# Altium schematic sheet X_core_Powerful_pull_up.SchDoc
size A4; SheetNumber: 7; SheetTotal: 7
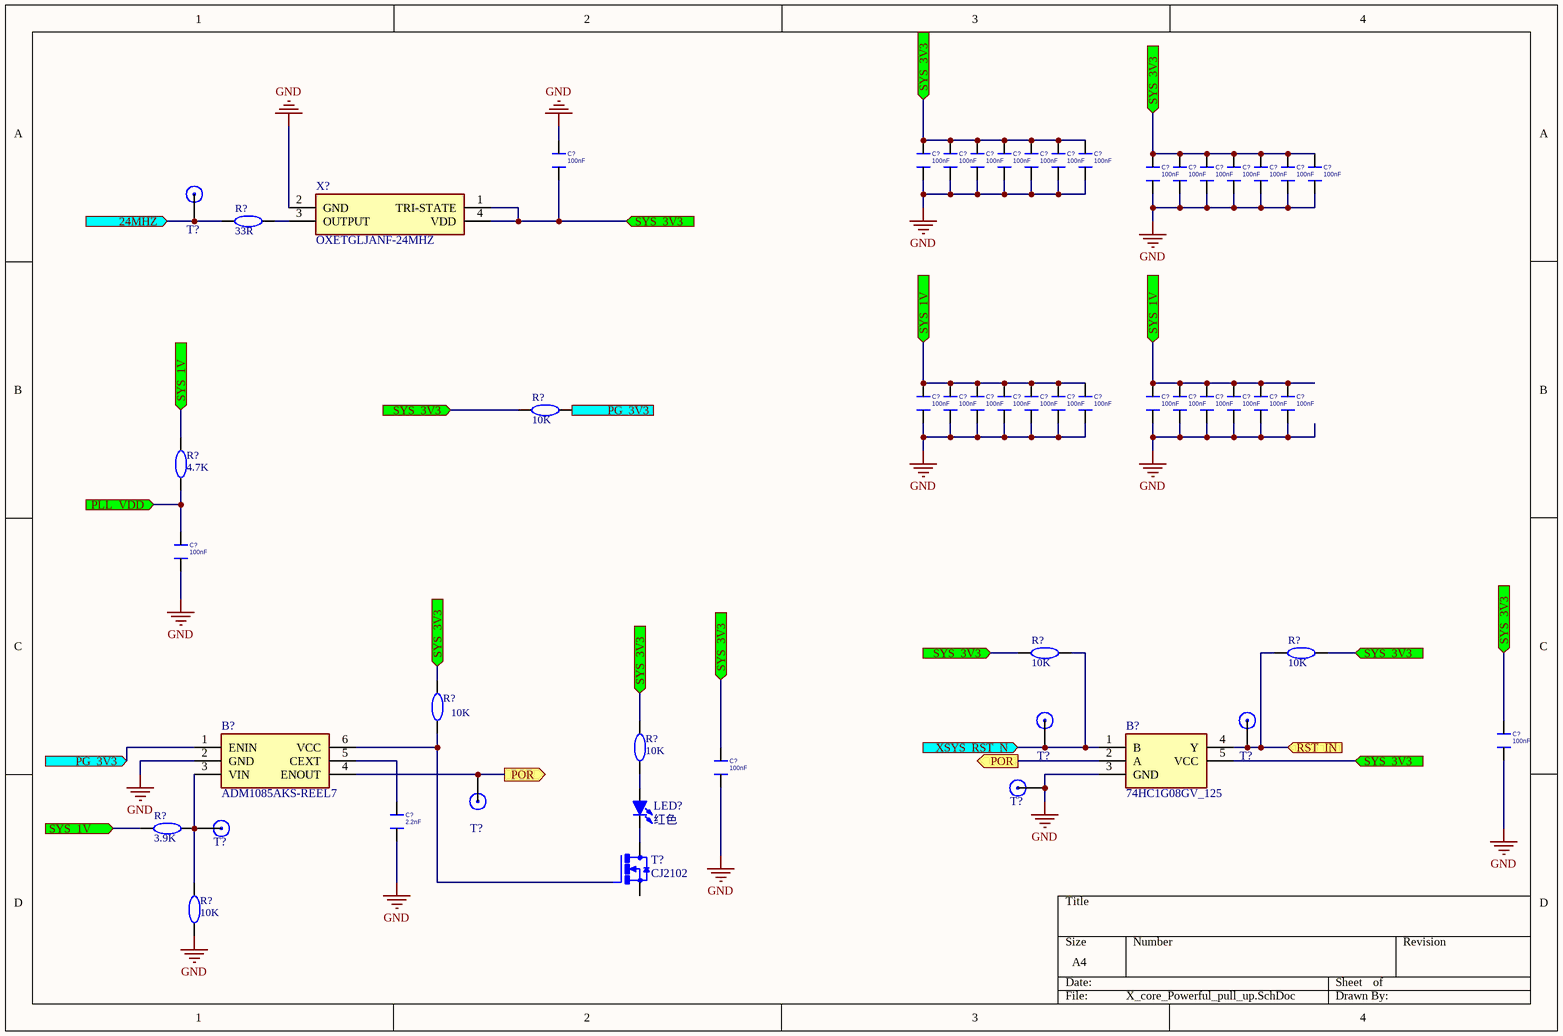
[diagram p0: X_core_Powerful_pull_up.SchDoc]

## Parts
(Parts that share a designator on the sheet are numbered #1, #2 ... from top to bottom, then left to right.)
B?#1  ADM1085AKS-REEL7  [SOT65P210X110-6N]
B?#2  74HC1G08GV_125  [SOT65P212X110-5N]
C?#1  100nF  [C0603]
C?#2  100nF  [C0603]
C?#3  100nF  [C0603]
C?#4  100nF  [C0603]
C?#5  100nF  [C0603]
C?#6  100nF  [C0603]
C?#7  100nF  [C0603]
C?#8  100nF  [C0603]
C?#9  100nF  [C0603]
C?#10  100nF  [C0603]
C?#11  100nF  [C0603]
C?#12  100nF  [C0603]
C?#13  100nF  [C0603]
C?#14  100nF  [C0603]
C?#15  100nF  [C0603]
C?#16  100nF  [C0603]
C?#17  100nF  [C0603]
C?#18  100nF  [C0603]
C?#19  100nF  [C0603]
C?#20  100nF  [C0603]
C?#21  100nF  [C0603]
C?#22  100nF  [C0603]
C?#23  100nF  [C0603]
C?#24  100nF  [C0603]
C?#25  100nF  [C0603]
C?#26  100nF  [C0603]
C?#27  100nF  [C0603]
C?#28  100nF  [C0603]
C?#29  100nF  [C0603]
C?#30  100nF  [C0603]
C?#31  100nF  [C0603]
C?#32  2.2nF  [C0603]
LED?  红色  [LED 0805G]
R?#1  Comment_1: 33R  [R 0603]  (hidden comment: 1A保险丝)
R?#2  1A保险丝  [R 0603]  (value not drawn)
R?#3  Comment_1: 4.7K  [R 0603]  (hidden comment: 1A保险丝)
R?#4  1A保险丝  [R 0603]  (value not drawn)
R?#5  1A保险丝  [R 0603]  (value not drawn)
R?#6  1A保险丝  [R 0603]  (value not drawn)
R?#7  1A保险丝  [R 0603]  (value not drawn)
R?#8  Comment_1: 3.9K  [R 0603]  (hidden comment: 1A保险丝)
R?#9  1A保险丝  [R 0603]  (value not drawn)
T?#1  Test_point  [Test_point]  (value not drawn)
T?#2  Test_point  [Test_point]  (value not drawn)
T?#3  Test_point  [Test_point]  (value not drawn)
T?#4  Test_point  [Test_point]  (value not drawn)
T?#5  Test_point  [Test_point]  (value not drawn)
T?#6  Test_point  [Test_point]  (value not drawn)
T?#7  CJ2102  [SOT23]
X?  OXETGLJANF-24MHZ  [OXETGLJANF24MHZ]

## Ports
24MHZ (in), PG_3V3 (in), PLL_VDD (in), POR (out), RST_IN (in), SYS_1V (in), SYS_3V3 (in), XSYS_RST_N (in)

## Nets
GND: B?#1.2(GND) B?#2.3(GND) C?#1.2 C?#2.1 C?#3.1 C?#4.1 C?#5.1 C?#6.1 C?#7.1 C?#8.1 C?#9.1 C?#10.1 C?#11.1 C?#12.1 C?#13.1 C?#14.1 C?#15.1 C?#16.1 C?#17.1 C?#18.1 C?#19.1 C?#20.1 C?#21.1 C?#22.1 C?#23.1 C?#24.1 C?#25.1 C?#26.1 C?#27.1 C?#28.1 C?#29.1 C?#30.1 C?#31.1 C?#32.1 R?#9.2 T?#4.1 X?.2(GND)
24MHZ: R?#1.1 T?#1.1 ; port 24MHZ
PG_3V3: B?#1.1(ENIN) R?#2.1 ; port PG_3V3
PLL_VDD: C?#29.2 R?#3.1 ; port PLL_VDD
POR: B?#1.4(ENOUT) B?#2.2(A) T?#5.1 ; port POR
RST_IN: B?#2.4(Y) R?#5.2 T?#3.1 ; port RST_IN
SYS_1V: C?#16.2 C?#17.2 C?#18.2 C?#19.2 C?#20.2 C?#21.2 C?#22.2 C?#23.2 C?#24.2 C?#25.2 C?#26.2 C?#27.2 C?#28.2 R?#3.2 R?#8.2 ; port SYS_1V
SYS_3V3: B?#2.5(VCC) C?#1.1 C?#2.2 C?#3.2 C?#4.2 C?#5.2 C?#6.2 C?#7.2 C?#8.2 C?#9.2 C?#10.2 C?#11.2 C?#12.2 C?#13.2 C?#14.2 C?#15.2 C?#30.2 C?#31.2 R?#2.2 R?#4.1 R?#5.1 R?#6.1 R?#7.1 X?.1(TRI-STATE) X?.4(VDD) ; port SYS_3V3
XSYS_RST_N: B?#2.1(B) R?#4.2 T?#2.1 ; port XSYS_RST_N
NetB?#1_3: B?#1.3(VIN) R?#8.1 R?#9.1 T?#6.1
NetB?#1_5: B?#1.5(CEXT) C?#32.2
NetB?#1_6: B?#1.6(VCC) R?#6.2 T?#7.1(G)
NetLED?_1: LED?.1 R?#7.2
NetLED?_2: LED?.2 T?#7.3(D)
NetR?#1_2: R?#1.2 X?.3(OUTPUT)

Not connected (* = marked no-connect by the designer): T?#7 2(S)

## Library data of the parts
B?#1 = ADM1085AKS-REEL7: IC SIMPLE SEQUENCER OD SC70-6; Manufacturer_Name: Analog Devices; Geometry.Height: 1.1mm; Manufacturer_Part_Number: ADM1085AKS-REEL7; Mouser Part Number: *; Mouser Price/Stock: *; Arrow Part Number: *; Arrow Price/Stock: *; Datasheet Link: http://www.analog.com/media/en/technical-documentation/data-sheets/ADM1085_1086_1087.pdf
B?#2 = 74HC1G08GV_125: 74HC(T)1G08 - 2-input AND gate@en-us; Manufacturer_Name: Nexperia; Manufacturer_Part_Number: 74HC1G08GV,125; Geometry.Height: 1.1mm; Mouser Part Number: 771-74HC1G08GV; Mouser Price/Stock: https://www.mouser.co.uk/ProductDetail/Nexperia/74HC1G08GV125?qs=P62ublwmbi9shys2yLaZlQ%3D%3D; Arrow Part Number: 74HC1G08GV,125; Arrow Price/Stock: https://www.arrow.com/en/products/74hc1g08gv125/nexperia?region=nac; Datasheet Link: https://assets.nexperia.com/documents/data-sheet/74HC_HCT1G08.pdf
C?#1-C?#32 = CAPACITOR_0_Dup3: CAP ±20%/10V/X5R/SMT0603; PAGE: 1
LED? = LED-SMD: 贴片LED; 版权归属: 源创客; BOM名称: 贴片LED; 学习资源: www.ooocke.com
R?#1-R?#9 = 10K: Published: 8-Jun-2000; LatestRevisionDate: 17-Jul-2002; LatestRevisionNote: Re-released for DXP Platform.; PackageReference: AXIAL-0.4; Publisher: Altium Limited
  R?#2 R?#4-R?#7 R?#9: Comment_1: 10K
T?#7 = CJ2102: N-Channel 20V  2.1ASOT-323; MP: MMBF170; MF: ON Semiconductor; Availability: Unavailable; Package: SOT-23 ON Semiconductor; SnapEDA_Link: https://www.snapeda.com/parts/MMBF170/ON%20Semiconductor/view-part/1400962/?ref=snap; Price: None; Value: *
X? = OXETGLJANF-24MHZ: 3.3V~3.3V -40~+85 15mA +/-50ppm 24MHz SMD3225-4P Oscillators ROHS; Manufacturer_Name: TAITIEN; Geometry.Height: 1.1mm; Manufacturer_Part_Number: OXETGLJANF-24MHZ; Mouser Part Number: *; Mouser Price/Stock: *; Arrow Part Number: *; Arrow Price/Stock: *; Datasheet Link: https://datasheet.lcsc.com/lcsc/1811052217_TAITIEN-Elec-OXETGLJANF-24MHZ_C295524.pdf